# Altium schematic sheet Keyboard.SchDoc
size A
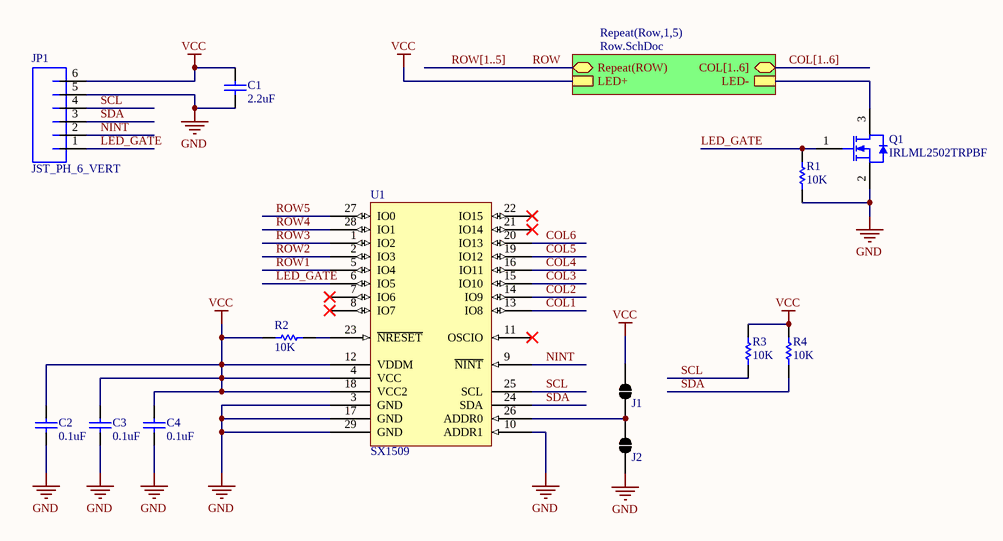
[diagram p0: Keyboard.SchDoc]

## Parts
C1  2.2uF  [CAPC0603(1608)100_N]
C2  0.1uF  [CAPC0603(1608)100_N]
C3  0.1uF  [CAPC0603(1608)100_N]
C4  0.1uF  [CAPC0603(1608)100_N]
J1  ADDR_H  [SOLDER JUMPER]  (value not drawn)
J2  ADDR_L  [SOLDER JUMPER]  (value not drawn)
JP1  JST_PH_6_VERT  [JST_PH_6_MIRRORABLE]
Q1  IRLML2502TRPBF  [INTR-SOT-23-3_V]
R1  10K  [RESC0603(1608)_N]
R2  10K  [RESC0603(1608)_N]
R3  10K  [RESC0603(1608)_N]
R4  10K  [RESC0603(1608)_N]
U1  SX1509  [QFN_UT_28]

## Sub-sheets
Repeat(Row,1,5) = Row.SchDoc: COL[1..6] (bidir), Repeat(ROW) (bidir), LED+, LED-

## Nets
GND: C1.2 C2.1 C3.1 C4.1 J2.1 JP1.5 Q1.2(S) R1.1 U1.3(GND) U1.10(ADDR1) U1.17(GND) U1.29(GND)
VCC: C1.1 C2.2 C3.2 C4.2 J1.2 JP1.6 R2.2 R3.1 R4.1 U1.4(VCC) U1.12(VDDM) U1.18(VCC2) ; sheet Repeat(Row,1,5)/LED+
COL1: U1.13(IO8)
COL2: U1.14(IO9)
COL3: U1.15(IO10)
COL4: U1.16(IO11)
COL5: U1.19(IO12)
COL6: U1.20(IO13)
LED_GATE: JP1.1 Q1.1(G) R1.2 U1.6(IO5)
NINT: JP1.2 U1.9(~{NINT})
ROW: sheet Repeat(Row,1,5)/Repeat(ROW)
ROW1: U1.5(IO4)
ROW2: U1.2(IO3)
ROW3: U1.1(IO2)
ROW4: U1.28(IO1)
ROW5: U1.27(IO0)
SCL: JP1.4 R3.2 U1.25(SCL)
SDA: JP1.3 R4.2 U1.24(SDA)
NetJ1_1: J1.1 J2.2 U1.26(ADDR0)
NetQ1_3: Q1.3(D) ; sheet Repeat(Row,1,5)/LED-
NetR2_1: R2.1 U1.23(~{NRESET})

Not connected (* = marked no-connect by the designer): U1 7(IO6)* 8(IO7)* 11(OSCIO)* 21(IO14)* 22(IO15)*

## Buses and harness runs
bus COL[1..6] = sheet Repeat(Row,1,5)/COL[1..6]
bus ROW[1..5]

## Library data of the parts
C1 = CMP-1035-02767-1: CAP 2.2uF 25V ±10% 0603 (1608 Metric) Thickness 1mm SMD; Case-EIA: 0603; Tolerance: Â±10%; Case-Metric: 1608; Technology: SMT; Value: 2.2uF; Max Thickness: 1 mm; Rated Voltage: 25 V
C2-C4 = CMP-1035-02595-1: CAP 100nF 100V ±10% 0603 (1608 Metric) Thickness 1mm SMD; Tolerance: Â±10%; Case-EIA: 0603; Case-Metric: 1608; Rated Voltage: 100 V; Value: 100nF; Technology: SMT; Max Thickness: 1 mm
J1 J2 = Solder Jumper
JP1 = JST_PH_6_VERT: PartNumber: B6B-PH-K-S(LF)(SN); Manufacturer: JST Sales America Inc.; PackageReference: JST-PH; Mounting Technology: Through Hole
Q1 = CMP-2000-04985-1: N-Channel HEXFET(R) Power MOSFET, 20 V VDS, +/- 12 V VGS, 4.2 A, 3-Pin SOT23, RoHS, Tape and Reel; Manufacturer: International Rectifier; Drain-to-Source Voltage [Vdss]: 20V; Drain-Source On Resistance-Max: 0.045O; Qg Gate Charge: 8nC; Rated Power Dissipation: 1.25W; Package Reference: SOT-23-3; Manufacturer URL: http://internationalrectifier.com/; Package Description: 3-Pin Small Outline Transistor, Body 2.92 x 1.3 mm, Pitch 0.95 mm; Datasheet Version: Apr-14; Channel Type: N-Channel; Datasheet URL: https://datasheet.ciiva.com/6383/irlml2502pbf-6383216.pdf
R1-R4 = CMP-1012-00098-1: 10K 0.1W 5% 0603 (1608 Metric)  SMD; Case-EIA: 0603; Value: 10000.00 Ohm; Case-Metric: 1608; Technology: SMT; Tolerance: 5 %; Power: 0.1 W
U1 = SX1509: Supplier 1: Mouser; Supplier 2: Digi-Key; Supplier 3: Digi-Key; Supplier Part Number 1: 947-SX1509BIULTRT; Supplier Part Number 2: SX1509BIULDKR-ND; Supplier Part Number 3: SX1509BIULCT-ND